# EAGLE design thegardening2.1 (EAGLE 9.1.3)
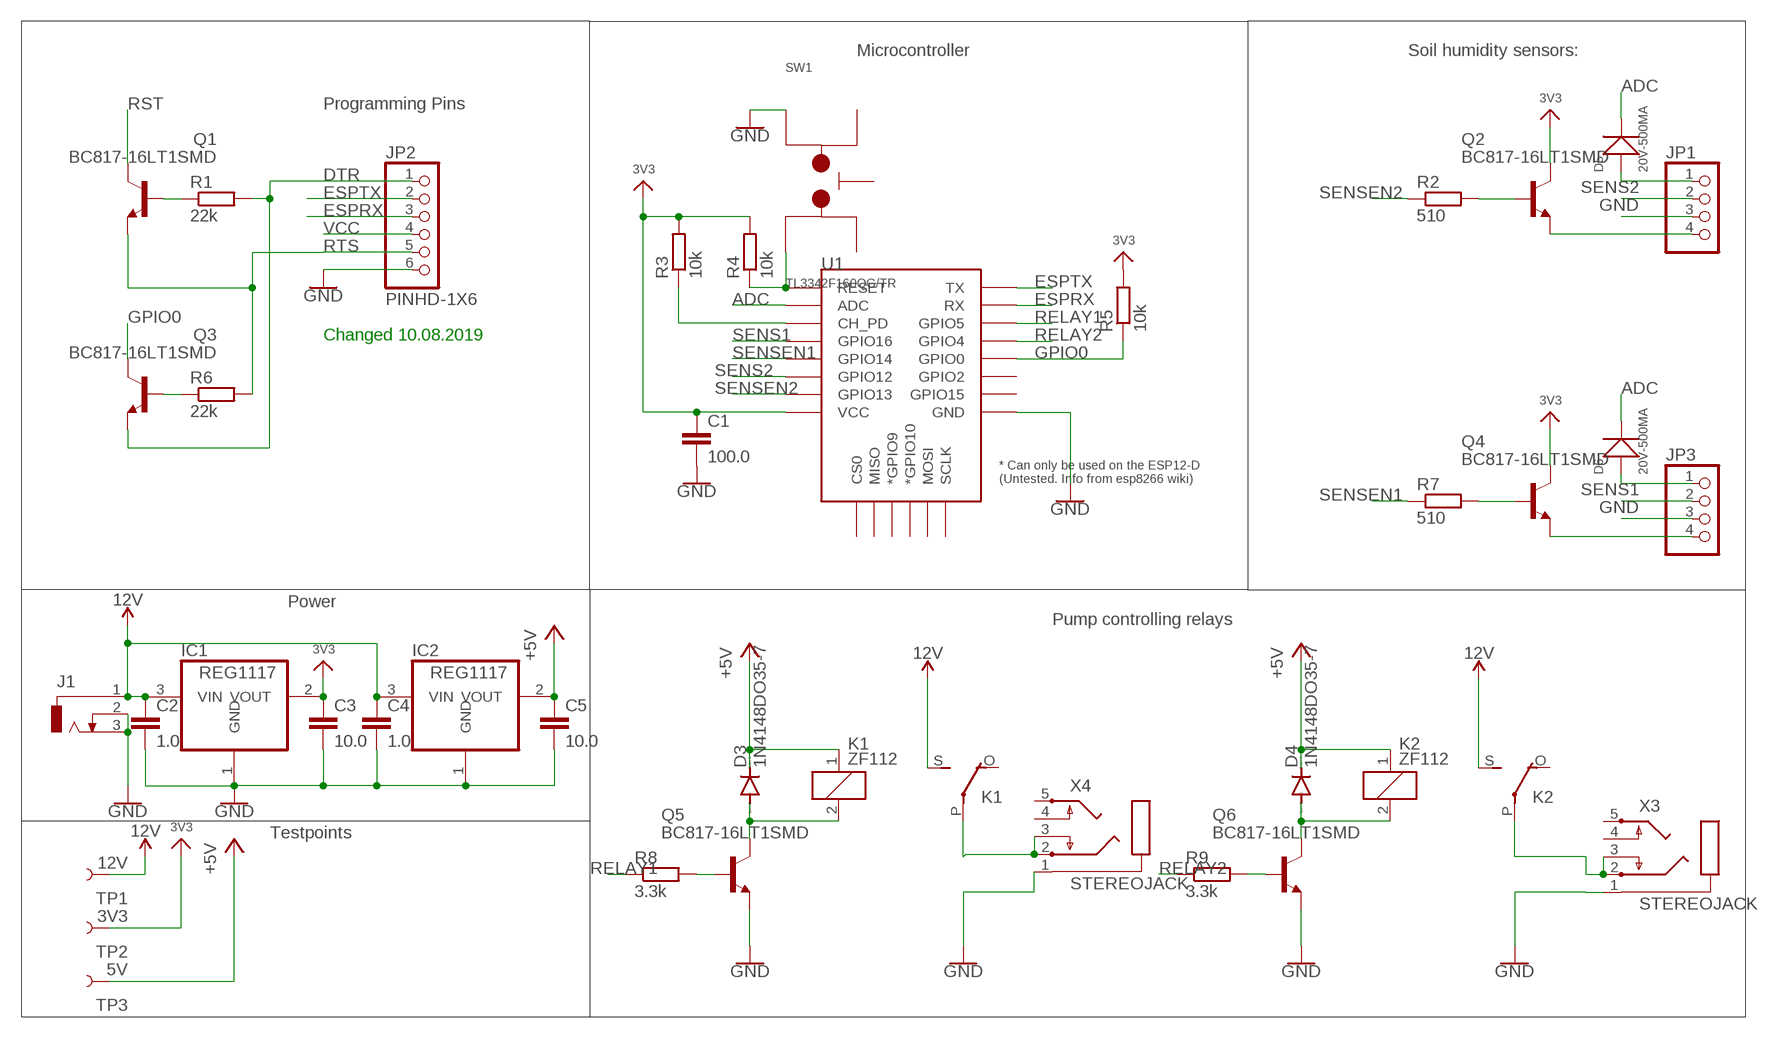
[diagram p0: schematic, sheet 1]

## Parts
C1  100.0  C-EUC0805  [C0805]
C2  1.0  C-EUC0805  [C0805]
C3  10.0  C-EUC0805  [C0805]
C4  1.0  C-EUC0805  [C0805]
C5  10.0  C-EUC0805  [C0805]
D3  1N4148DO35-7  [DO35-7]
D4  1N4148DO35-7  [DO35-7]
D5  20V-500MA  SMD-DIODE-SCHOTTKY-20V-500MA(SOD-123)  [SOD-123]
D6  20V-500MA  SMD-DIODE-SCHOTTKY-20V-500MA(SOD-123)  [SOD-123]
IC1  REG1117  [SOT223]
IC2  REG1117  [SOT223]
J1  DCJ0303  [DCJ0303]
JP1  PINHD-1X4  [1X04]
JP2  PINHD-1X6  [1X06]
JP3  PINHD-1X4  [1X04]
K1  ZF112  [ZF112]
K2  ZF112  [ZF112]
Q1  BC817-16LT1SMD  [SOT23-BEC]
Q2  BC817-16LT1SMD  [SOT23-BEC]
Q3  BC817-16LT1SMD  [SOT23-BEC]
Q4  BC817-16LT1SMD  [SOT23-BEC]
Q5  BC817-16LT1SMD  [SOT23-BEC]
Q6  BC817-16LT1SMD  [SOT23-BEC]
R1  22k  R-EU_R0805  [R0805]
R2  510  R-EU_R0805  [R0805]
R3  10k  R-EU_R0805  [R0805]
R4  10k  R-EU_R0805  [R0805]
R5  10k  R-EU_R0805  [R0805]
R6  22k  R-EU_R0805  [R0805]
R7  510  R-EU_R0805  [R0805]
R8  3.3k  R-EU_R0805  [R0805]
R9  3.3k  R-EU_R0805  [R0805]
SW1  TL3342F160QG/TR  [TL3342F160QG/TR]
TP1  12V  TEST-POINTTP_15TH_THRU  [TP_15TH]
TP2  3V3  TEST-POINTTP_15TH_THRU  [TP_15TH]
TP3  5V  TEST-POINTTP_15TH_THRU  [TP_15TH]
U1  ESP12ESMD  [ESP12E-SMD]
X3  STEREOJACK  [STX3100]
X4  STEREOJACK  [STX3100]

## Nets
+5V: C5.1 D3.C D4.C IC2.2(VOUT) K1.1 K2.1 TP3.P$1
ADC: D5.- D6.- U1.ADC
DTR: JP2.1 Q3.E R1.2
ESPRX: JP2.3 U1.RXD0(RX)
ESPTX: JP2.2 U1.TXD0(TX)
GND: C1.2 C2.2 C3.2 C4.2 C5.2 IC1.1(GND) IC2.1(GND) J1.2 J1.3 JP1.3 JP2.6 JP3.3 Q5.E Q6.E SW1.3 U1.GND X3.1 X4.1
GPIO0: Q3.C R5.1 U1.GPIO0
N$1: D3.A K1.2 Q5.C
N$2: K1.P(2:P) X4.2 X4.3
N$3: D5.+ JP1.1
N$4: D4.A K2.2 Q6.C
N$5: K2.P(2:P) X3.2 X3.3
N$6: JP3.4 Q4.E
N$7: JP1.4 Q2.E
N$8: Q2.B R2.2
N$9: Q4.B R7.2
N$10: D6.+ JP3.1
N$12: Q1.B R1.1
N$14: Q3.B R6.1
N$15: R3.1 U1.CH_PD
N$16: Q5.B R8.2
RELAY1: R8.1 U1.GPIO5
RELAY02: Q6.B R9.2
RELAY2: R9.1 U1.GPIO4
RST: Q1.C R4.1 SW1.1 U1.RESET
RTS: JP2.5 Q1.E R6.2
SENS1: JP3.2 U1.GPIO16
SENS2: JP1.2 U1.GPIO12
SENSEN1: R7.1 U1.GPIO14
SENSEN2: R2.1 U1.GPIO13
VCC: C1.1 C3.1 IC1.2(VOUT) JP2.4 Q2.C Q4.C R3.2 R4.2 R5.2 TP2.P$1 U1.VCC ; supply symbol labelled 3V3
VCC_2: C2.1 C4.1 IC1.3(VIN) IC2.3(VIN) J1.1 K1.S(2:S) K2.S(2:S) TP1.P$1 ; supply symbol labelled 12V
Unconnected: K1.O(2:O) K2.O(2:O) SW1.2 SW1.4 U1.CS0 U1.GPIO2 U1.GPIO9(*GPIO9) U1.GPIO10(*GPIO10) U1.GPIO15 U1.MISO U1.MOSI U1.SCLK X3.4 X3.5 X4.4 X4.5

## Notes on the sheet
- Microcontroller | Soil humidity sensors:
- Programming Pins
- Changed 10.08.2019
- Power
- Pump controlling relays
- Testpoints

## Library data of the parts
C1-C5 = resistor:C-EU: CAPACITOR, European symbol
D3 D4 = diode:1N4148: DIODE high speed (Philips)
D5 D6 = OPL_Discrete_Semiconductor:SMD-DIODE-SCHOTTKY-20V-500MA(SOD-123): 304020032; MPN: SS0520-7-F
IC1 IC2 = burr-brown:REG1117: 800mA and 1A Low Dropout (LDO) Positive Regulator 1.8V, 2.5V, 2.85V, 3.3V, 5V, and Adj; MPN: REG1117; OC_FARNELL: 1097566; OC_NEWARK: 14P6981
J1 = con-jack:DCJ0303: DC POWER JACK Source: DCJ0303.pdf; OC_FARNELL: unknown; OC_NEWARK: unknown
JP1 JP3 = DC_LOAD_AU:PINHD-1X4: PIN HEADER
JP2 = audio amplifier example:PINHD-1X6: PIN HEADER
K1 K2 = relay:ZF112: RELAY 1 x switch; OC_FARNELL: unknown; OC_NEWARK: unknown
Q1-Q6 = transistor-npn:BC817*: NPN Transistor
R1-R9 = rcl:R-EU_: RESISTOR, European symbol; SPICEPREFIX: R
SW1 = Switch:TL3342F160QG/TR: SWITCH TACTILE SPST-NO 0.05A 12V Manufacturer's datasheet <http://spec_sheets.e-switch.com/specs/P010632.pdf>; CREATED_BY: PCBLayout.com; DIGI_KEY_PART_NUMBER: EG2531CT-ND; MANUFACTURER: E-Switch; MPN: TL3342F160QG/TR; PACKAGE: SPST_NO
TP1-TP3 = SparkFun-Connectors:TEST-POINT: SparkFun Test Points Bare copper test points for troubleshooting or In-Circuit-Testing. These are used by our Production team for verifying production board runs using pogo-pins on test beds. SparkFun Products: SparkFun LSM9DS1 Breakout <https://www.sparkfun.com/products/13284> SparkFun PSOC <https://www.sparkfun.com/products/13714> SparkFun Load Cell Amplifier <https://www.sparkfun.com/products/13879>
U1 = esp8266modules:ESP12E: ESP12E Module
X3 X4 = audio amplifier example:STEREOJACK: MIC/HEADPHONE JACK Stereo jack with two switches. Kycon STX3100, CUI SJ1-3555NG and/or 4UCon 05544

## Board
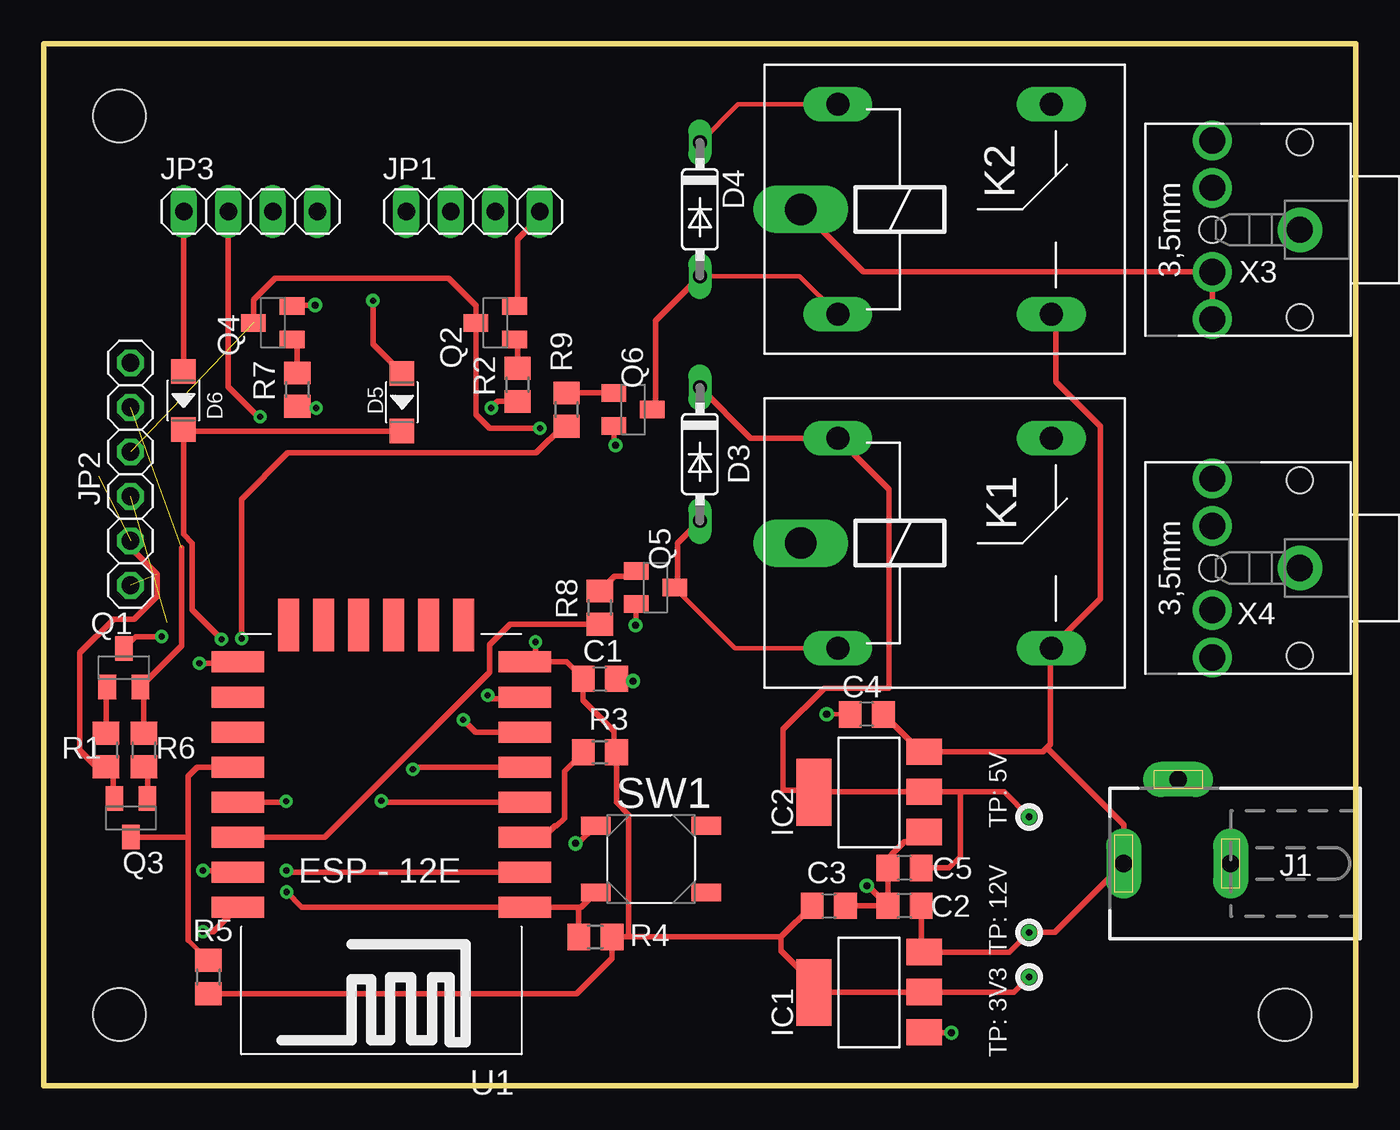
[diagram p1: board, top side]
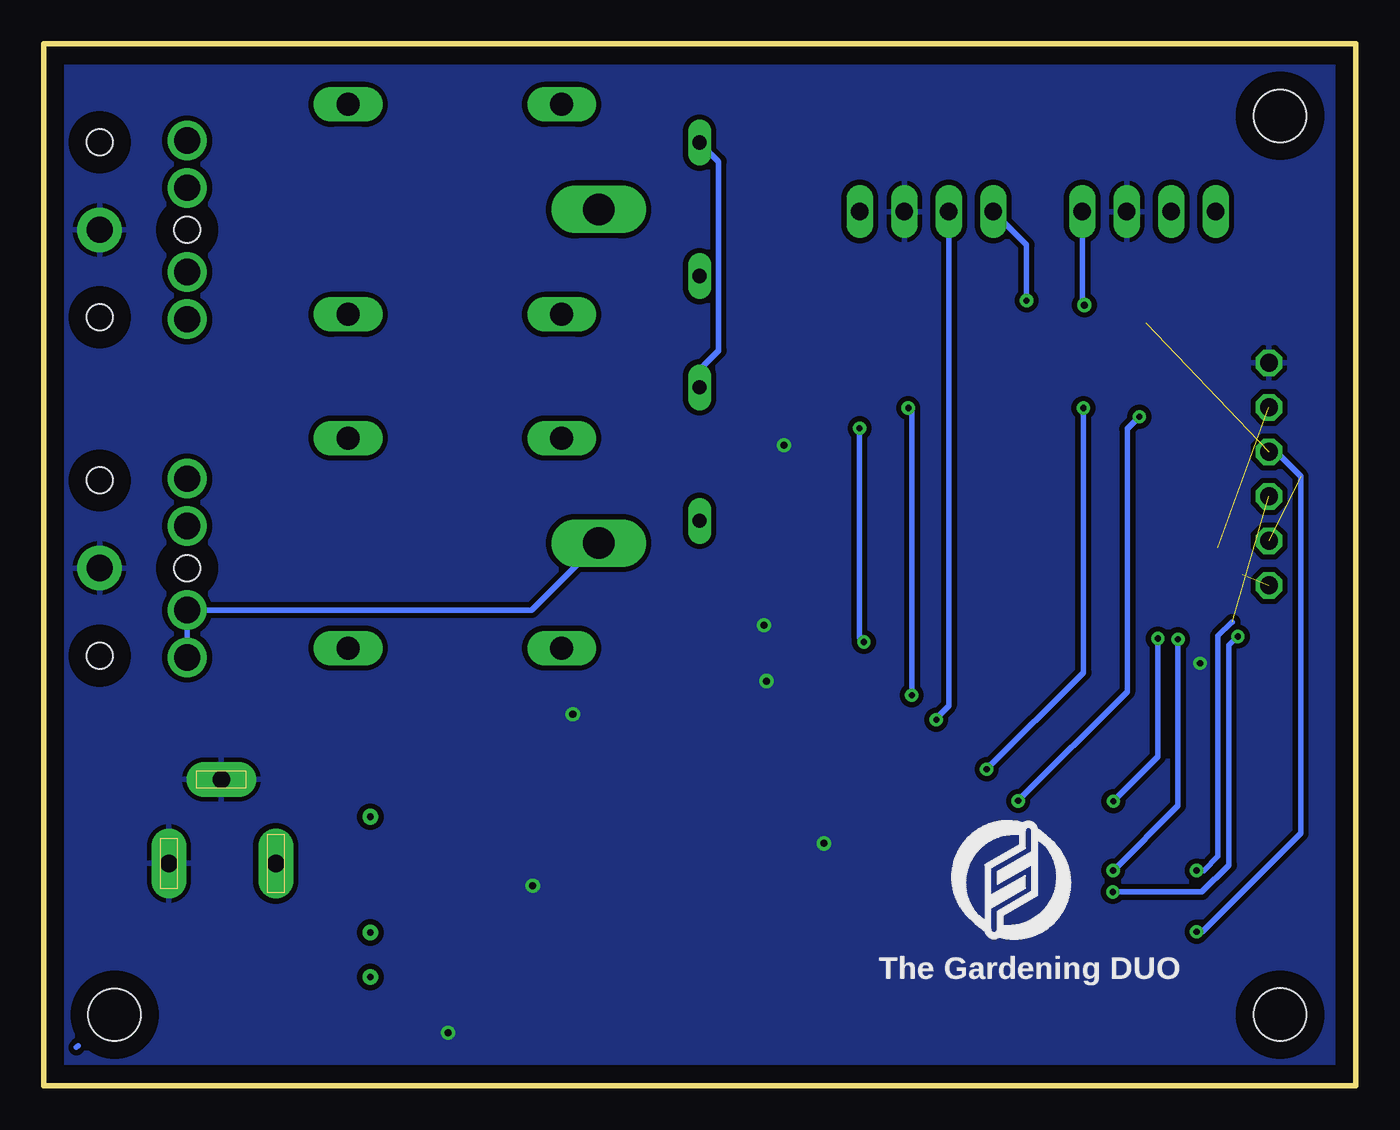
[diagram p2: board, bottom side, seen from below]

Size 74.91 x 59.49 mm. Coordinates in mm from the lower left corner, seen from the top.
Outline: 0,0 74.91,0 74.91,59.49 0,59.49 0,0
Copper layers (1*16): Top 0.035mm / dielectric 1.5mm / Bottom 0.035mm
Design rules "default *": minimum track width 0.25mm, minimum drill 0.35mm, track to track 0.3mm, track to pad 0.3mm, pad to pad 0.3mm, via to via 0.3mm, smd to smd 6mil, copper to edge 40mil, drill to drill 6mil, minimum pad ring 10mil, minimum via ring 8mil, stop-mask expansion 4mil, vias tented up to drill 0mil, thermal gap 10mil
Holes 3 mm at 4.32,55.37 70.87,4.06 4.32,4.07

### Footprints (pad centres in the part's own frame; a part is rotated, then mirrored left to right if it is on the bottom)
C0805 = smd 1.3 x 1.5: 1 -0.95,0; 2 0.95,0
DO35-7 = drill 0.813 long: A 3.81,0; C -3.81,0
SOD-123 = smd 1.397 x 1.397: + -1.651,0; - 1.651,0
SOT223 = smd 1.499 x 2.007: 1 -2.261,-3.15; 2 0.025,-3.15; 3 2.311,-3.15 | smd 3.81 x 2.007: 4 0,3.15
DCJ0303 = drill 1 pad 2 long: 1 0,3.1; 2 4.8,0; 3 0,-3
1X04 = drill 1.016 long: 1 -3.81,0; 2 -1.27,0; 3 1.27,0; 4 3.81,0
1X06 = drill 1.016 octagon: 1 -6.35,0; 2 -3.81,0; 3 -1.27,0; 4 1.27,0; 5 3.81,0; 6 6.35,0
ZF112 = drill 1.321 long: 1 -6.096,5.994; 2 -6.096,-5.994; O 6.096,5.994; S 6.096,-5.994 | drill 1.803 long: P -8.204,0
SOT23-BEC = smd 1 x 1.4: B -0.95,-1.1; C 0,1.1; E 0.95,-1.1
R0805 = smd 1.3 x 1.5: 1 -0.95,0; 2 0.95,0
TL3342F160QG/TR = smd 1.7 x 1: 1 -3.15,-1.9; 2 3.15,-1.9; 3 -3.15,1.9; 4 3.15,1.9
TP_15TH = drill 0.381 pad 0.61: P$1 0,0
ESP12E-SMD = smd 3 x 1.2: ADC -8.3,3.8; CH_PD -8.3,1.8; GND 8.1,-8.2; GPIO0 8.1,-2.2; GPIO2 8.1,-4.2; GPIO4 8.1,-0.2; GPIO5 8.1,1.8; GPIO12 -8.3,-4.2; GPIO13 -8.3,-6.2; GPIO14 -8.3,-2.2; GPIO15 8.1,-6.2; GPIO16 -8.3,-0.2; RESET -8.3,5.8; RXD0 8.1,3.8; TXD0 8.1,5.8; VCC -8.3,-8.2 | smd 1.2 x 3: CS0 -4.8,-10.3; GPIO9 -0.8,-10.3; GPIO10 1.2,-10.3; MISO -2.8,-10.3; MOSI 3.2,-10.3; SCLK 5.2,-10.3
STX3100 = drill 1.5 pad 2.54: 1 2.7,-0.1 | drill 1.5: 2 7.7,5; 3 7.7,2.3; 4 7.7,-2.5; 5 7.7,-5.2 | hole 1.5: 2.7,4.9; 2.7,-5.1; 7.7,-0.1

### Placement (x,y rotation side)
C1  31.75,23.24 0 top
C2  49.15,10.29 180 top
C3  44.83,10.29 0 top
C4  46.99,21.21 180 top
C5  49.15,12.45 180 top
D3  37.47,36.07 270 top
D4  37.47,50.04 270 top
D5  20.45,39.03 270 top
D6  7.97,39.13 270 top
IC1  47.12,5.33 90 top
IC2  47.12,16.76 90 top
J1  64.77,12.7 90 top
JP1  24.51,49.91 0 top
JP2  4.95,34.92 90 top
JP3  11.81,49.91 0 top
K1  51.44,30.99 0 top
K2  51.44,50.04 0 top
Q1  4.57,23.88 0 top
Q2  25.78,43.56 90 top
Q3  4.98,15.3 180 top
Q4  13.08,43.56 90 top
Q5  34.93,28.45 270 top
Q6  33.66,38.61 270 top
R1  3.56,19.18 270 top
R2  27.05,40.02 90 top
R3  31.75,19.05 0 top
R4  31.5,8.51 0 top
R5  9.4,6.22 270 top
R6  5.72,19.18 90 top
R7  14.48,39.75 90 top
R8  31.75,27.3 90 top
R9  29.84,38.61 90 top
SW1  34.67,12.95 0 top
TP1  56.26,8.76 0 top
TP2  56.26,6.22 0 top
TP3  56.26,15.37 0 top
U1  19.18,16 180 top
X3  74.42,48.77 180 top
X4  74.42,29.46 180 top

### Tracks (layer width: path | path; a pad name or v marks a point on that pad's centre or on a via)
+5V
  Top 0.25: K2.1 39.65,56.03 D4.C
  Top 0.3: 52.45,16.79 IC2.2 44.55,16.79 44.45,16.89 42.21,16.89 42.21,20.35 44.57,22.71 48.26,22.71 48.26,34.06 K1.1 40.36,36.98 D3.C | 52.45,16.79 54.84,16.79 TP3.P$1 | C5.1 51.69,12.45 52.32,13.08 52.32,16.66 52.45,16.79
  Bottom 0.3: D3.C 37.47,40.89 36.38,41.98 36.38,52.76 D4.C
ADC  (via drill 0.35 pad 0.4)
  Top 0.3: D5.- 8.07,37.38 D6.- 7.97,31.48 8.47,30.98 8.47,27.18 v10.15,25.5 | U1.ADC 13.95,12.2 v13.85,12.3
  Bottom 0.3: v10.15,25.5 10.15,16 v13.85,12.3
DTR  (1 unrouted)
  Top 0.3: 4.95,30.71 6.47,29.2 6.47,27.95 5.17,26.65 3.99,26.65 2.06,24.72 2.06,19.17 3.24,17.99 3.24,17.91 R1.2 3.96,17.83 3.96,16.4 Q3.E
ESPRX  (via drill 0.35 pad 0.4)  (1 unrouted)
  Top 0.3: v9.08,12.3 10.98,12.3 U1.RXD0
  Bottom 0.3: 7.05,26.48 7.07,26.48 7.86,25.69 7.86,13.1 8.66,12.3 v9.08,12.3
ESPTX  (via drill 0.35 pad 0.4)  (1 unrouted)
  Top 0.3: U1.TXD0 9.68,8.8 v9.08,8.8
  Bottom 0.3: 4.55,36.2 3.15,34.8 3.15,14.42 8.77,8.8 v9.08,8.8
GND  (via drill 0.35 pad 0.3, 0.4 pad 0.3)
  Top 0.25: v44.7,21.21 C4.2
  Top 0.3: SW1.3 30.51,13.84 v30.35,13.84 | C1.2 33.53,23.24 v33.66,23.11 | Q6.E 32.56,36.66 v32.64,36.58 | Q5.E 33.83,26.33 v33.78,26.29 | C2.2 C5.2 48.2,13.02 48.39,13.21 48.4,13.21 49.14,13.95 49.71,13.95 IC2.1 | C2.2 C3.2 | C2.2 47.06,11.43 v46.99,11.43 | IC1.1 50.29,3.05 v51.82,3.05 | U1.GND 11.01,24.13 v8.89,24.13
  pour Bottom: -3.81,66.04 -3.81,-1.27 76.2,-1.27 76.2,66.04
GPIO0
  Top 0.25: 8.26,8.32 R5.1
  Top 0.3: 8.26,14.2 8.26,17.69 8.76,18.2 U1.GPIO0 | 8.26,14.2 8.26,8.32 | Q3.C 8.26,14.2
N$1
  Top 0.25: K1.2 39.48,24.99 Q5.C
  Top 0.3: D3.A 36.2,30.99 36.2,28.45 Q5.C
N$2
  Bottom 0.3: K1.P 47.06,27.16 X4.3 X4.2
N$3  (via drill 0.35 pad 0.55)
  Top 0.3: D5.+ 18.8,42.33 v18.8,44.83
  Bottom 0.3: v18.8,44.83 18.8,48.01 JP1.1
N$4
  Top 0.25: D4.A 43.16,46.23 K2.2
  Top 0.3: D4.A 34.93,43.69 34.93,38.61 Q6.C
N$5
  Top 0.3: K2.P 46.8,46.47 X3.3 X3.2
N$6  (via drill 0.4 pad 0.55)
  Top 0.3: Q4.E 14.35,44.51 14.41,44.58 v15.49,44.58
  Bottom 0.3: JP3.4 15.62,44.58 v15.49,44.58
N$7
  Top 0.3: JP1.4 28.32,49.59 27.05,48.32 27.05,44.51 Q2.E
N$8
  Top 0.3: R2.2 27.05,42.61 Q2.B
N$9
  Top 0.3: R7.2 14.48,42.61 Q4.B
N$10
  Top 0.3: D6.+ 8,40.8 JP3.1
N$11
  Bottom 0.3: 72.95,2.3 73.05,2.2
N$12
  Top 0.3: Q1.B 3.56,22.71 R1.1
N$14
  Top 0.3: R6.1 5.93,18.02 Q3.B
N$15
  Top 0.3: R3.1 29.73,17.98 29.73,15.29 29.29,14.85 29.2,14.85 28.19,13.84 27.84,14.2 U1.CH_PD
N$16
  Top 0.3: Q5.B 33.66,29.08 32.77,29.08 32.58,29.08 R8.2
RELAY1
  Top 0.3: R8.1 26.61,26.36 25.45,25.2 25.45,23.62 16.03,14.2 U1.GPIO5
RELAY02
  Top 0.3: Q6.B 32.39,39.56 R9.2
RELAY2  (via drill 0.35 pad 0.3)
  Top 0.3: U1.GPIO4 13.78,16.2 v13.84,16.26 | R9.1 29.64,37.66 28.11,36.13 13.93,36.13 11.29,33.49 11.29,27.35 11.29,27.34 v11.29,25.54
  Bottom 0.3: v13.84,16.26 11.29,18.8 v11.29,25.54
RST  (via drill 0.35 pad 0.3)
  Top 0.3: R4.1 30.55,10.08 SW1.1 30.67,10.2 U1.RESET 14.74,10.2 v13.86,11.08 | v6.73,25.65 5.25,25.65 Q1.C
  Bottom 0.3: v6.73,25.65 7.24,25.15 7.24,12.61 8.77,11.08 v13.86,11.08
RTS  (1 unrouted)
  Top 0.3: R6.2 5.72,22.58 Q1.E 7.87,25.13 7.87,30.73
SENS1  (via drill 0.35 pad 0.4)
  Top 0.3: JP3.2 10.54,39.92 12.45,38.01 12.45,38.11 v12.35,38.2 | U1.GPIO16 19.35,16.2 v19.28,16.27
  Bottom 0.3: v19.28,16.27 13.05,22.5 13.05,37.51 v12.35,38.2
SENS2  (via drill 0.35 pad 0.4)
  Top 0.3: v23.95,20.9 24.65,20.2 U1.GPIO12
  Bottom 0.3: v23.95,20.9 23.95,21 23.24,21.71 JP1.2
SENSEN1  (via drill 0.35 pad 0.4)
  Top 0.3: U1.GPIO14 21.21,18.2 v21.08,18.07 | v15.55,38.7 14.58,38.7 R7.1
  Bottom 0.3: v21.08,18.07 15.55,23.6 v15.55,38.7
SENSEN2  (via drill 0.35 pad 0.4)
  Top 0.3: R2.1 25.92,39.07 v25.55,38.7 | v25.35,22.3 25.55,22.1 27.38,22.1 U1.GPIO13
  Bottom 0.3: v25.35,22.3 25.35,38.5 v25.55,38.7
VCC  (via drill 0.35 pad 0.4)  (1 unrouted)
  Top 0.3: 44.48,5.36 IC1.2 55.4,5.36 TP2.P$1 | 44.48,5.36 44.45,5.33 | 33.4,8.51 R4.2 32.45,7.3 30.42,5.27 R5.2 | 33.4,8.51 42.1,8.51 | 42.1,8.51 C3.1 | 44.48,5.36 42.1,7.73 42.1,8.51 | 33.4,8.51 33.4,15.49 32.7,16.2 R3.2 32.57,19.18 32.57,20.26 30.8,22.03 C1.1 29.84,24.2 U1.VCC 28.08,24.2 v28.08,25.35 | Q4.C 11.98,44.87 13.21,46.1 23.11,46.1 24.68,44.53 Q2.C 24.68,38.31 25.46,37.54 v28.33,37.54
  Bottom 0.3: v28.33,37.54 28.33,25.6 v28.08,25.35
VCC_2
  Top 0.3: K2.S 57.79,44.01 57.79,40.2 60.33,37.66 60.33,27.81 57.79,25.27 K1.S 57.47,24.96 57.47,19.49 57.28,19.3 | C4.1 50.07,19.07 IC2.3 57.05,19.07 57.28,19.3 | 57.28,19.3 61.67,14.91 J1.1 57.73,8.76 TP1.P$1 55.14,7.64 IC1.3 50.1,7.81 C2.1

### Text on the board
tPlace: TP: 5V | TP: 12V | TP: 3V3
bPlace: The Gardening DUO